# Altium schematic sheet PowerBoard_FileInfo.SchDoc
size A; SheetNumber: 3; SheetTotal: 4
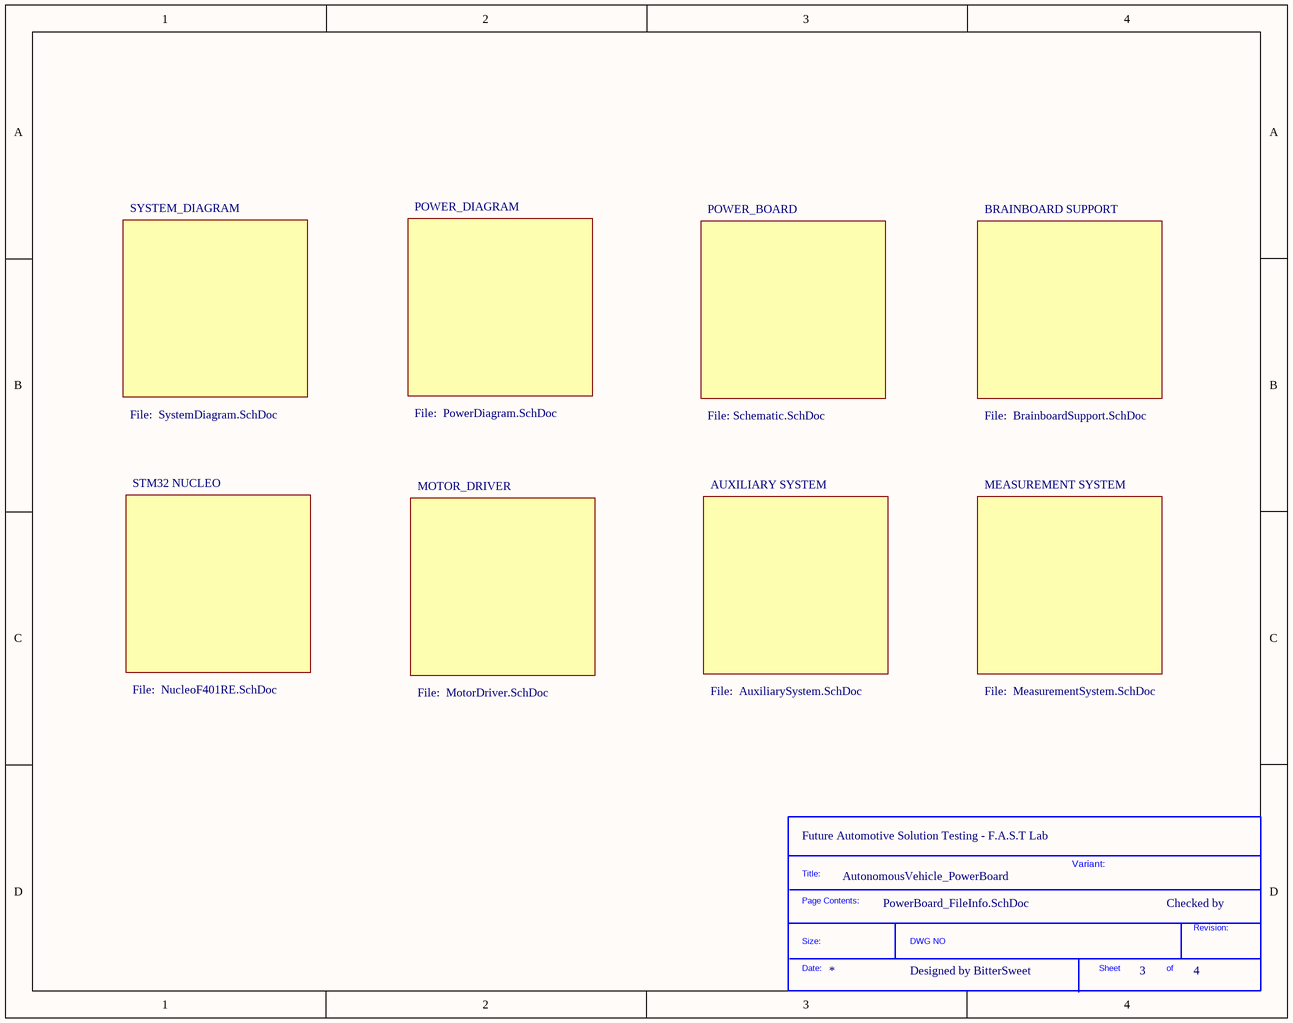
[diagram p0: PowerBoard_FileInfo.SchDoc]

## Parts
*?  SDTitleBlock  (value not drawn)  (graphical)

## Notes on the sheet
- SYSTEM_DIAGRAM
- POWER_DIAGRAM
- POWER_BOARD
- BRAINBOARD SUPPORT
- File:  SystemDiagram.SchDoc
- File:  PowerDiagram.SchDoc
- File: Schematic.SchDoc
- File:  BrainboardSupport.SchDoc
- STM32 NUCLEO
- MOTOR_DRIVER
- AUXILIARY SYSTEM
- MEASUREMENT SYSTEM
- File:  NucleoF401RE.SchDoc
- File:  MotorDriver.SchDoc
- File:  AuxiliarySystem.SchDoc
- File:  MeasurementSystem.SchDoc
- (near *?) Future Automotive Solution Testing - F.A.S.T Lab
- AutonomousVehicle_PowerBoard
- Variant:
- Checked by
- Designed by BitterSweet
- (in symbol SDTitleBlock) Title:; Page Contents:; Revision:; Size:; DWG NO; Date:; Sheet; of